# EAGLE schematic ph_for_cadizv41_pcbv0 (EAGLE 6.1)
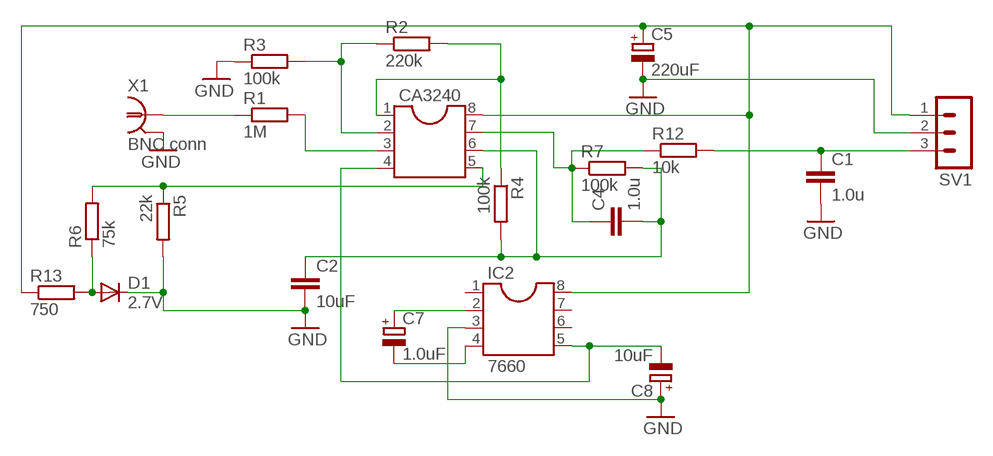
[diagram p0: schematic, sheet 1]

## Parts
C1  1.0u  C-EU102-043X133  [C102-043X133]
C2  10uF  C-EU102-043X133  [C102-043X133]
C4  1.0u  C-EU102-043X133  [C102-043X133]
C5  220uF  CPOL-EUE5-6  [E5-6]
C7  1.0uF  CPOL-EUE5-6  [E5-6]
C8  10uF  CPOL-EUE5-6  [E5-6]
CA3240  DIL8  [DIL08]
D1  2.7V  1N4148DO35-7  [DO35-7]
IC2  7660  DIL8  [DIL08]
R1  1M  R-EU_0207/12  [0207/12]
R2  220k  R-EU_0207/12  [0207/12]
R3  100k  R-EU_0207/12  [0207/12]
R4  100k  R-EU_0207/12  [0207/12]
R5  22k  R-EU_0207/12  [0207/12]
R6  75k  R-EU_0207/12  [0207/12]
R7  100k  R-EU_0207/12  [0207/12]
R12  10k  R-EU_0207/12  [0207/12]
R13  750  R-EU_0207/12  [0207/12]
SV1  MA03-1  [MA03-1]
X1  BNC conn  R141426  [R141426]

## Nets
GND: C1.2 C2.2 C5.- C8.+ D1.C IC2.3 R3.1 R5.2 SV1.2 X1.2(GND)
N$1: CA3240.1 R2.2 R4.1
N$2: CA3240.2 R2.1 R3.2
N$3: CA3240.3 R1.2
N$4: C7.+ IC2.2
N$5: CA3240.5 R5.1 R6.2
N$6: C7.- IC2.4
N$7: D1.A R6.1 R13.2
N$8: C4.1 CA3240.7 R7.1 R12.1
N$9: C2.1 C4.2 CA3240.6 R4.2 R7.2
N$10: C1.1 R12.2 SV1.3
N$11: C8.- CA3240.4 IC2.5
N$12: R1.1 X1.1
N$13 [ph]: C5.+ CA3240.8 IC2.8 R13.1 SV1.1
Unconnected: IC2.1 IC2.6 IC2.7

## Power pins joined to a net without a drawn wire
GND: X1.3(GND) X1.4(GND) X1.5(GND)

## Library data of the parts
C1 C2 C4 = resistor:C-EU: CAPACITOR, European symbol
C5 C7 C8 = resistor:CPOL-EU: POLARIZED CAPACITOR, European symbol
CA3240 IC2 = ic-package:DIL8: Dual In Line / Socket
D1 = diode:1N4148: DIODE high speed (Philips)
R1-R7 R12 R13 = resistor:R-EU_: RESISTOR, European symbol
SV1 = con-lstb:MA03-1: PIN HEADER; OC_FARNELL: unknown; OC_NEWARK: unknown
X1 = con-coax:R141426: BNC COAX CONNECTOR Radiall 50/75 Ohm Spoerle; MF: FARNELL; MPN: R141426161; OC_FARNELL: 4195115; OC_NEWARK: 14J7919

## Net classes
1 ph: width 0.254 mm, clearance 0.127 mm